# EAGLE schematic cartridge_breakout (EAGLE 9.5.2)
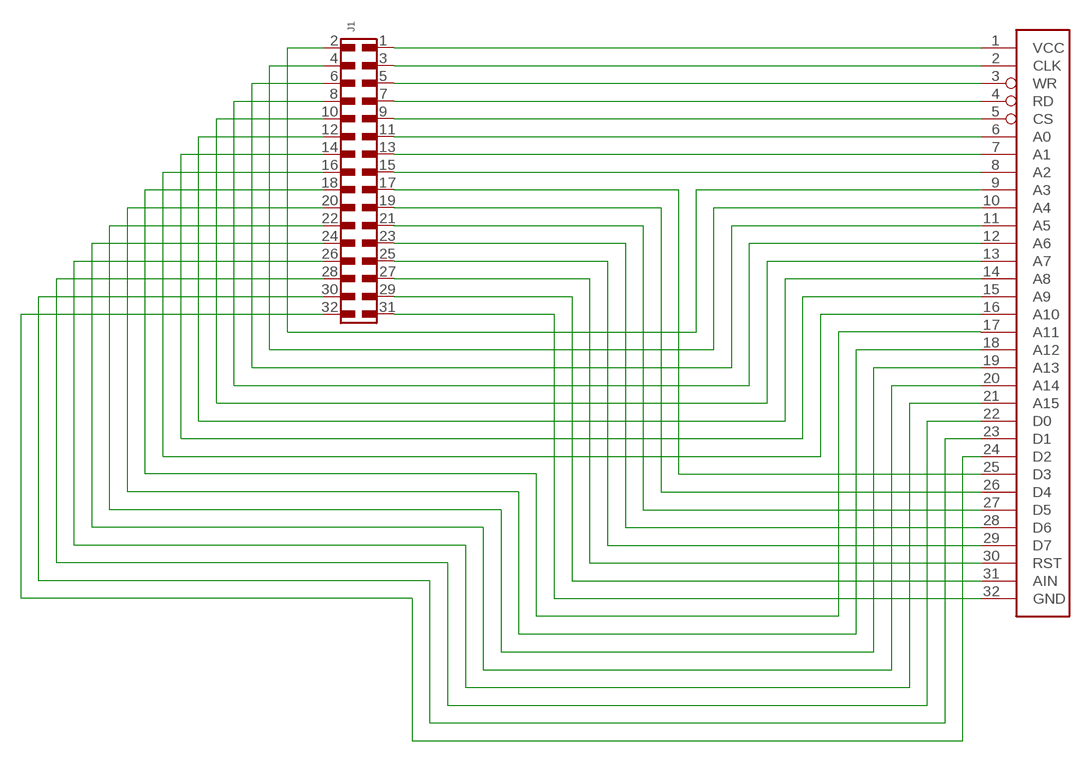
[diagram p0: schematic, sheet 1]

## Parts
J1  6100XX21121_61003221121  [61003221121]
U$2  GB-CARTRIDGE-SLOT5  [GB-CARTRIDGE-SLOT-5]

## Nets
N$1: J1.1 U$2.1(VCC)
N$2: J1.3 U$2.2(CLK)
N$3: J1.5 U$2.3(WR)
N$4: J1.7 U$2.4(RD)
N$5: J1.9 U$2.5(CS)
N$6: J1.11 U$2.6(A0)
N$7: J1.13 U$2.7(A1)
N$8: J1.15 U$2.8(A2)
N$9: J1.2 U$2.9(A3)
N$10: J1.4 U$2.10(A4)
N$11: J1.6 U$2.11(A5)
N$12: J1.8 U$2.12(A6)
N$13: J1.10 U$2.13(A7)
N$14: J1.12 U$2.14(A8)
N$15: J1.14 U$2.15(A9)
N$16: J1.16 U$2.16(A10)
N$17: J1.17 U$2.25(D3)
N$18: J1.19 U$2.26(D4)
N$19: J1.21 U$2.27(D5)
N$20: J1.23 U$2.28(D6)
N$21: J1.25 U$2.29(D7)
N$22: J1.27 U$2.30(RST)
N$23: J1.29 U$2.31(AIN)
N$24: J1.31 U$2.32(GND)
N$25: J1.18 U$2.17(A11)
N$26: J1.20 U$2.18(A12)
N$27: J1.22 U$2.19(A13)
N$28: J1.24 U$2.20(A14)
N$29: J1.26 U$2.21(A15)
N$30: J1.28 U$2.22(D0)
N$31: J1.30 U$2.23(D1)
N$32: J1.32 U$2.24(D2)

## Library data of the parts
J1 = Eagle_WR-PHD (rev19a):6100XX21121_61003221121: WR-PHD 2.54 mm SMT Dual Pin Header ARTICLE PROPERTIES: Pins:4;​ 6;​ 8;​ 10;​ 12;​ 14;​ 16;​ 20;​ 22;​ 24;​ 26;​ 32;​ 34;​ 36 KIND PROPERTIES: Pitch：2.54 mm Quality Class:3 as per CECC 75 301-802 Rows：Dual Gender：Pin Header Type：Straight MATERIAL PROPERTIES: Insulator Material :PA6T Insulator Flammability Rating:UL94 V-0 Contact Material:Copper Alloy Contact Plating:Gold Contact Type:Stamped GENERAL INFORMATION Operating Temperature:-40 up to +125 °C Compliance:Lead free / RoHS ELECTRICAL PROPERTIES: Rated Current:3 A IR 1:3 A Withstanding Voltage:500 V (AC) Contact Resistance:20 mΩ RISO:1000 MΩ CERTIFICATION UL Approval:E323964 PACKAGING PROPERTIES Packaging:Tube <https://katalog.we-online.com/media/images/v2/o33205v209%20Family_WR-PHD_610xxx21121.jpg> Details see: https://katalog.we-online.com/en/em/PHD_2_54_SMT_DUAL_PIN_HEADER_6100XX21121 Updated by Yingchun,Shan 2019-10-18 2019 (C) Würth Elektronik; DATASHEET-URL: https://katalog.we-online.com/em/datasheet/61003221121.pdf; GENDER: Pin Header; IR: 3A; MATES: WR-PHD 2.54mm Angled DualSocket Header/Dual Socket Header/Dual Socket Header Bottom Entry/Dual Socket Header Bottom Entry Large/SMT Dual Socket Header/SMT Dual Socket Header Bottom Entry; PACKAGING: Tube; PART-NUMBER: 61003221121; PINS: 32; ROWS: Dual; TYPE: Straight
U$2 = jrodrigo-gameboy:GB-CARTRIDGE-SLOT